# Altium schematic sheet blm_ctrl_cortex.SchDoc
size A4; DrawnBy: mcattin; Organization: E-ROBOT; DocumentNumber: 2; SheetNumber: 2; SheetTotal: 2
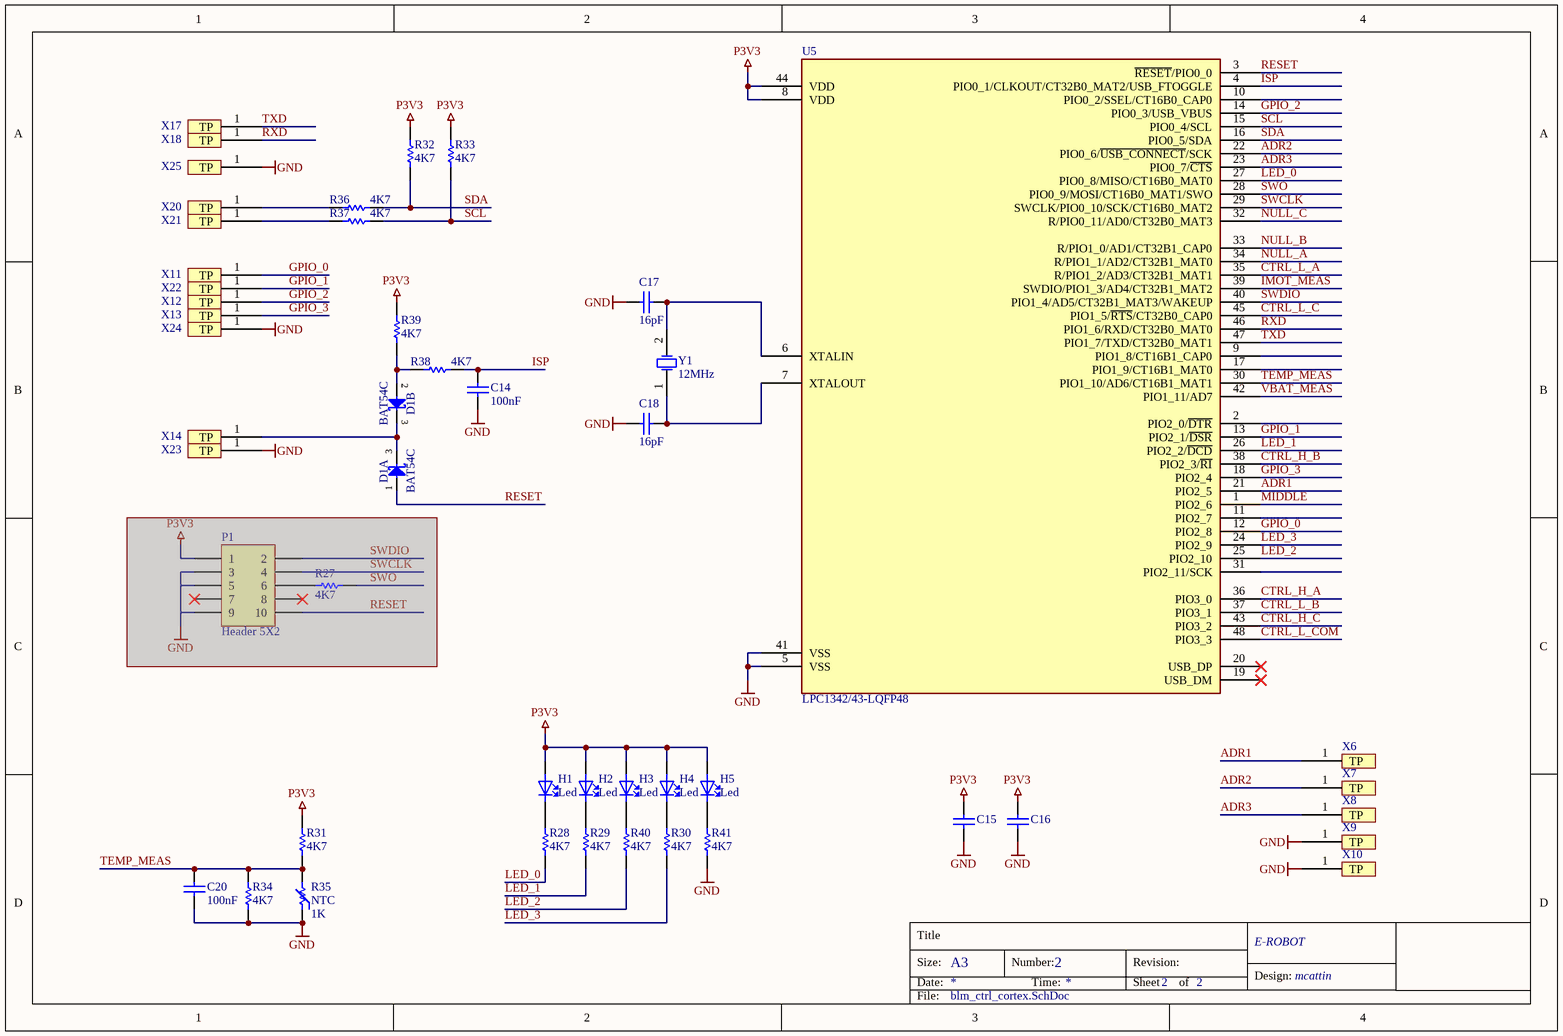
[diagram p0: blm_ctrl_cortex.SchDoc]

## Parts
C14  value 100nF  [0603]  (hidden comment: Cap)
C15  Cap  [0603]  (value not drawn)
C16  Cap  [0603]  (value not drawn)
C17  value 16pF  [0603]  (hidden comment: Cap)
C18  value 16pF  [0603]  (hidden comment: Cap)
C20  value 100nF  [0603]  (hidden comment: Cap)
D1  BAT54C  [SOT95P240X130-3N]  (parts A,B of 2)
H1  Led  [0603_LED]
H2  Led  [0603_LED]
H3  Led  [0603_LED]
H4  Led  [0603_LED]
H5  Led  [0603_LED]
P1  Header 5X2  [HDR2X5]  (masked out: inside a compile mask, not in the netlist)
R27  value 4K7  [0603]  (hidden comment: Res1)  (masked out: inside a compile mask, not in the netlist)
R28  value 4K7  [0603]  (hidden comment: Res1)
R29  value 4K7  [0603]  (hidden comment: Res1)
R30  value 4K7  [0603]  (hidden comment: Res1)
R31  value 4K7  [0603]  (hidden comment: Res1)
R32  value 4K7  [0603]  (hidden comment: Res1)
R33  value 4K7  [0603]  (hidden comment: Res1)
R34  value 4K7  [0603]  (hidden comment: Res1)
R35  NTC  value 1K  [0603]
R36  value 4K7  [0603]  (hidden comment: Res1)
R37  value 4K7  [0603]  (hidden comment: Res1)
R38  value 4K7  [0603]  (hidden comment: Res1)
R39  value 4K7  [0603]  (hidden comment: Res1)
R40  value 4K7  [0603]  (hidden comment: Res1)
R41  value 4K7  [0603]  (hidden comment: Res1)
U5  LPC1342/43-LQFP48  [TSQFP50P900X900-48N]
X6  (no value)  [PAD_SMD_0.5x1MM]
X7  (no value)  [PAD_SMD_0.5x1MM]
X8  (no value)  [PAD_SMD_0.5x1MM]
X9  (no value)  [PAD_SMD_0.5x1MM]
X10  (no value)  [PAD_SMD_0.5x1MM]
X11  (no value)  [PAD_SMD_1x2MM]
X12  (no value)  [PAD_SMD_1x2MM]
X13  (no value)  [PAD_SMD_1x2MM]
X14  (no value)  [PAD_SMD_1x2MM]
X17  (no value)  [PAD_SMD_1x2MM]
X18  (no value)  [PAD_SMD_1x2MM]
X20  (no value)  [PAD_SMD_1x2MM]
X21  (no value)  [PAD_SMD_1x2MM]
X22  (no value)  [PAD_SMD_1x2MM]
X23  (no value)  [PAD_SMD_1x2MM]
X24  (no value)  [PAD_SMD_1x2MM]
X25  (no value)  [PAD_SMD_1x2MM]
Y1  12MHz  [QUARTZ_SMD_CX5032]

## Nets
GND: C14.2 C15.2 C16.2 C17.1 C18.1 C20.2 R34.2 R35.2 R41.2 U5.5(VSS) U5.41(VSS) X9.1(TP) X10.1(TP) X23.1(TP) X24.1(TP) X25.1(TP)
P3V3: C15.1 C16.1 H1.1(ANODE) H2.1(ANODE) H3.1(ANODE) H4.1(ANODE) H5.1(ANODE) R31.1 R32.1 R33.1 R39.2 U5.8(VDD) U5.44(VDD)
ADR1: U5.21(PIO2_5) X6.1(TP)
ADR2: U5.22(PIO0_6/~{USB_CONNECT}/SCK) X7.1(TP)
ADR3: U5.23(PIO0_7/~{CTS}) X8.1(TP)
CTRL_H_A: U5.36(PIO3_0)
CTRL_H_B: U5.38(PIO2_3/~{RI})
CTRL_H_C: U5.43(PIO3_2)
CTRL_L_A: U5.35(R/PIO1_2/AD3/CT32B1_MAT1)
CTRL_L_B: U5.37(PIO3_1)
CTRL_L_C: U5.45(PIO1_5/~{RTS}/CT32B0_CAP0)
CTRL_L_COM: U5.48(PIO3_3)
GPIO_0: U5.12(PIO2_8) X11.1(TP)
GPIO_1: U5.13(PIO2_1/~{DSR}) X22.1(TP)
GPIO_2: U5.14(PIO0_3/USB_VBUS) X12.1(TP)
GPIO_3: U5.18(PIO2_4) X13.1(TP)
IMOT_MEAS: U5.39(SWDIO/PIO1_3/AD4/CT32B1_MAT2)
ISP: C14.1 R38.1 U5.4(PIO0_1/CLKOUT/CT32B0_MAT2/USB_FTOGGLE)
LED_0: R28.2 U5.27(PIO0_8/MISO/CT16B0_MAT0)
LED_1: R29.2 U5.26(PIO2_2/~{DCD})
LED_2: R40.2 U5.25(PIO2_10)
LED_3: R30.2 U5.24(PIO2_9)
MIDDLE: U5.1(PIO2_6)
NULL_A: U5.34(R/PIO1_1/AD2/CT32B1_MAT0)
NULL_B: U5.33(R/PIO1_0/AD1/CT32B1_CAP0)
NULL_C: U5.32(R/PIO0_11/AD0/CT32B0_MAT3)
RESET: D1.1(A) U5.3(~{RESET}/PIO0_0)
RXD: U5.46(PIO1_6/RXD/CT32B0_MAT0) X18.1(TP)
SCL: R33.2 R37.1 U5.15(PIO0_4/SCL)
SDA: R32.2 R36.1 U5.16(PIO0_5/SDA)
SWCLK: U5.29(SWCLK/PIO0_10/SCK/CT16B0_MAT2)
SWDIO: U5.40(PIO1_4/AD5/CT32B1_MAT3/WAKEUP)
SWO: U5.28(PIO0_9/MOSI/CT16B0_MAT1/SWO)
TEMP_MEAS: C20.1 R31.2 R34.1 R35.1 U5.30(PIO1_10/AD6/CT16B1_MAT1)
TXD: U5.47(PIO1_7/TXD/CT32B0_MAT1) X17.1(TP)
VBAT_MEAS: U5.42(PIO1_11/AD7)
NetC17_2: C17.2 U5.6(XTALIN) Y1.2(OSC2)
NetC18_2: C18.2 U5.7(XTALOUT) Y1.1(OSC1)
NetD1_2: D1.2(A) R38.2 R39.1
NetD1_3: D1.3(COMC) X14.1(TP)
NetH1_2: H1.2(CATHODE) R28.1
NetH2_2: H2.2(CATHODE) R29.1
NetH3_2: H3.2(CATHODE) R40.1
NetH4_2: H4.2(CATHODE) R30.1
NetH5_2: H5.2(CATHODE) R41.1
NetR36_2: R36.2 X20.1(TP)
NetR37_2: R37.2 X21.1(TP)

Not connected (* = marked no-connect by the designer): U5 2(PIO2_0/~{DTR}) 9(PIO1_8/CT16B1_CAP0) 10(PIO0_2/SSEL/CT16B0_CAP0) 11(PIO2_7) 17(PIO1_9/CT16B1_MAT0) 19(USB_DM)* 20(USB_DP)* 31(PIO2_11/SCK)

## Notes on the sheet
- Title
- Size:
- Date:
- A3
- Number:
- Time:
- Revision:
- Sheet
- of
- Design:
- File:

## Library data of the parts
C14-C18 C20 = Cap: Capacitor; Case: 0603
D1 = BAT54C: Dual Common Cathode Schottky Diodes; Part Description: Dual Common Cathode Small Signal Schottky Diode; Manufacturer: FAIRCHILD SEMICONDUCTOR; Fournisseur: Farnell; Ref_fournisseur: 1081192; Part Number: BAT54C; Component Kind: Standard; Device: BAT54C; Case: SOT23-3; Author: CERN DEM JLC; Price: 0.758 CHF
H1-H5 = Led: Led low current; Fournisseur: *; Ref_fournisseur: *; Case: 0603
P1 = Header 5X2: Header, 5-Pin, Dual row; LatestRevisionDate: 17-Jul-2002; LatestRevisionNote: Re-released for DXP Platform.; Publisher: Altium Limited
R27-R34 R36-R41 = Res1: Resistor
  R27: Published: 8-Jun-2000; LatestRevisionDate: 17-Jul-2002; LatestRevisionNote: Re-released for DXP Platform.; PackageReference: AXIAL-0.3; Publisher: Altium Limited
  R28-R34 R36-R41: Case: 0603
R35 = NTC: Temperature dependent resistor; Case: 0603
U5 = LPC1342/43-LQFP48: Manufacturer: NXP; Part Description: 32-bit ARM Cortex-M3 microcontroller; up to 32 kB flash and 8 kB SRAM; USB device; Part Number: LPC1343FBD48; Device: LPC1343; Fournisseur: Farnell; Ref_fournisseur: 1762580; Case: LQFP48; Price: 9.60 CHF
X6-X14 X17 X18 X20-X25 = TEST_POINT
Y1 = XTAL: Crystal Oscillator; Manufacturer: AVX; Part Number: CX5032GB12000H0PESZZ; Device: Quartz; Fournisseur: Farnell; Ref_fournisseur: 1368769; Case: 5mm x 3.2mm; Value: 12 MHz; Price: 2.15 CHF